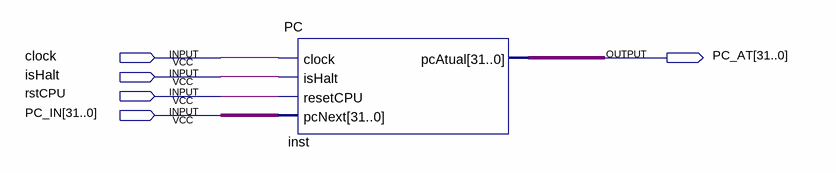
[diagram p0: schematic sheet]
// Quartus schematic testeDisplay.bdf as structural Verilog: 1 symbols, 5 pins
module testeDisplay (
  input  clock,
  input  isHalt,
  input  rstCPU,
  input  [31:0] PC_IN,
  output [31:0] PC_AT
);

  PC inst (.clock(clock), .isHalt(isHalt), .resetCPU(rstCPU), .pcNext(PC_IN), .pcAtual(PC_AT));
endmodule
